# Altium schematic sheet FPGA_1_V1_01.SchDoc
size A2; Date: Date; CompanyName: HESSO; Engineer: Name; Address1: Route du Rawyl 47; Address2: 1950 Sion; Address3: Switzerland; ProjectName: Project Name
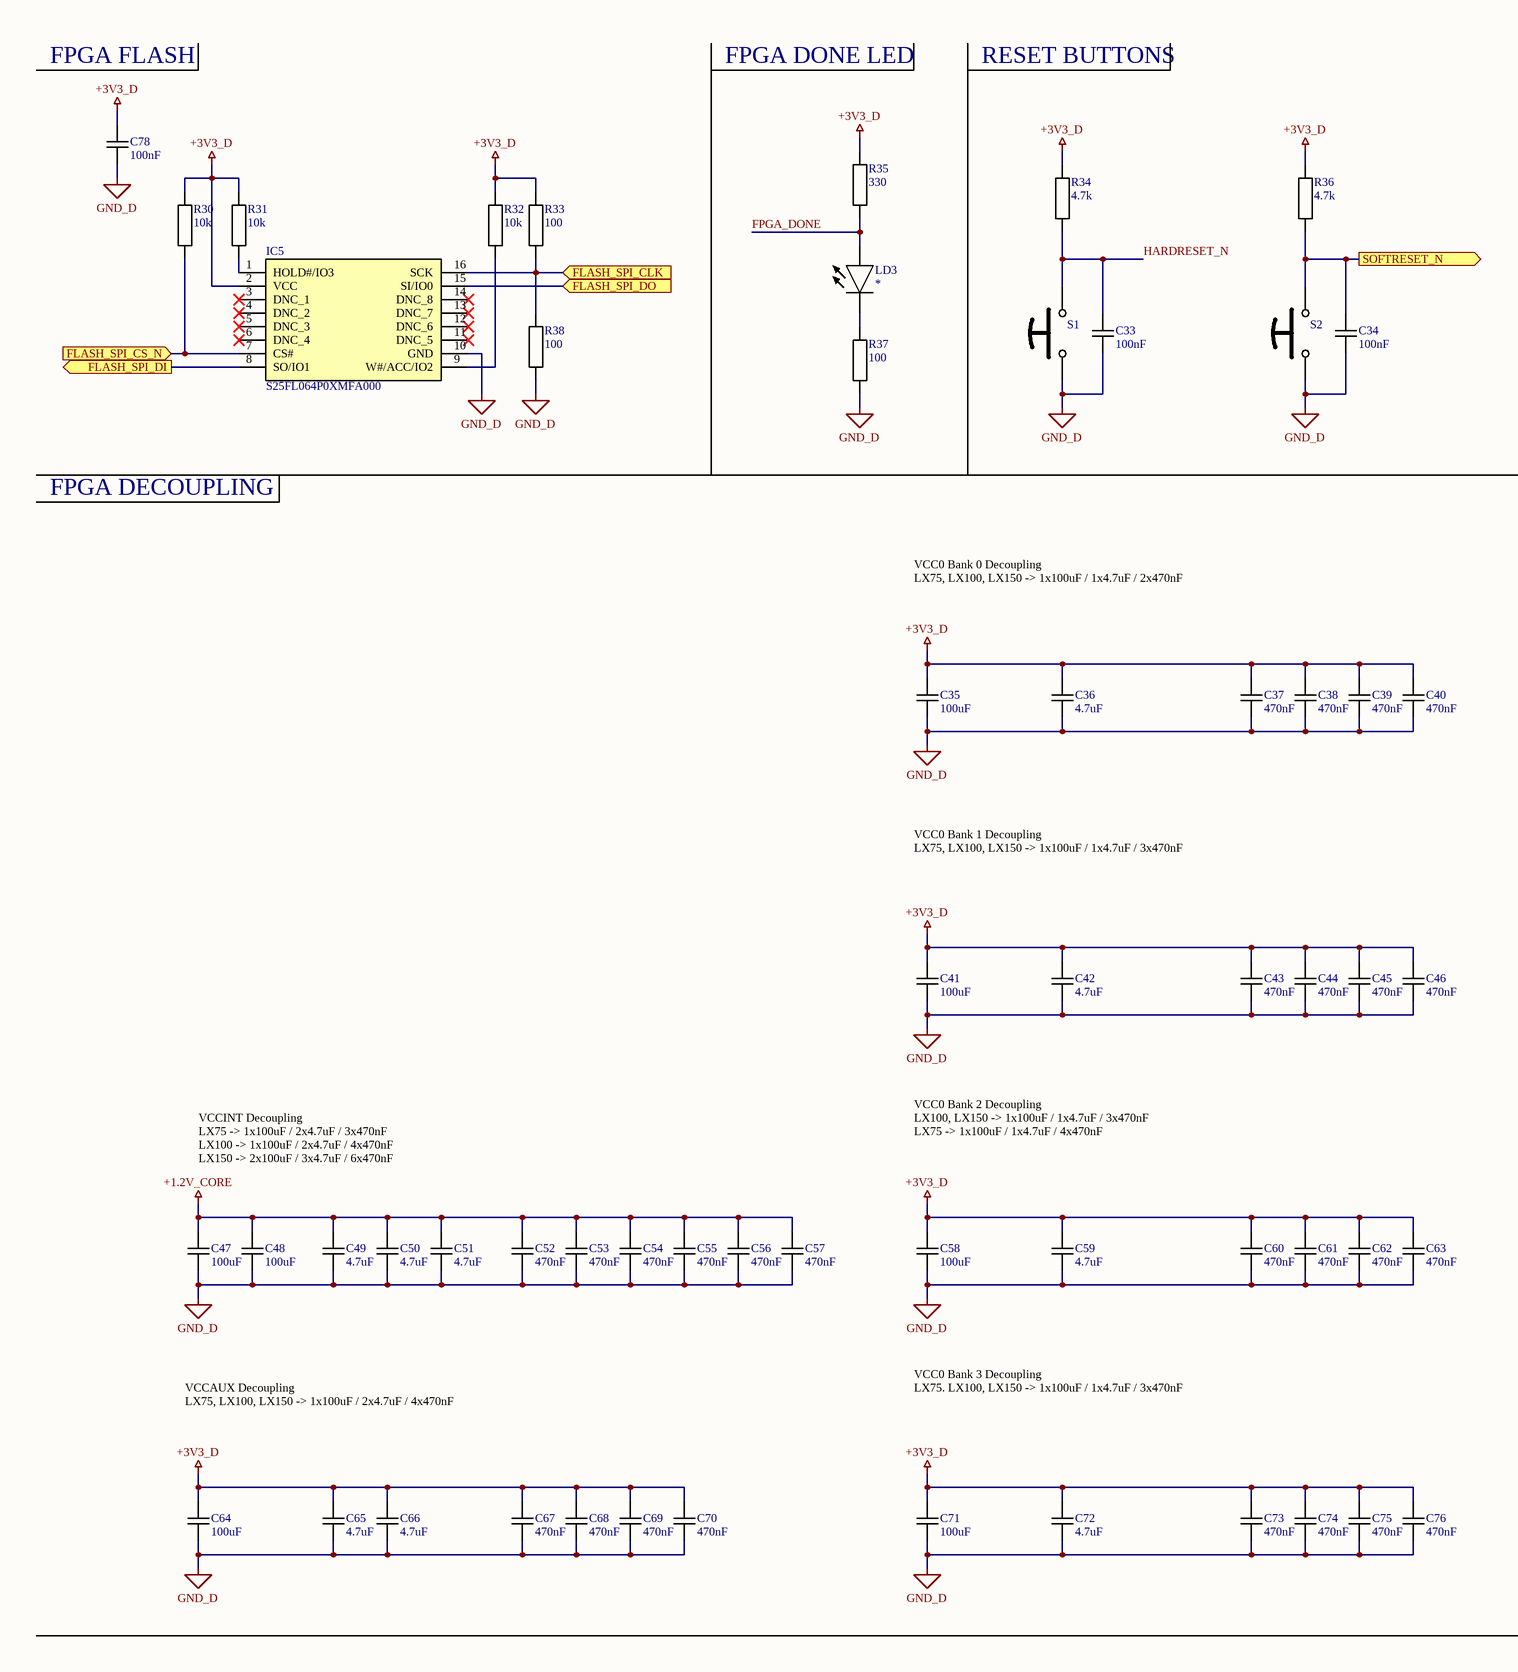
[diagram p0: FPGA_1_V1_01.SchDoc, left]
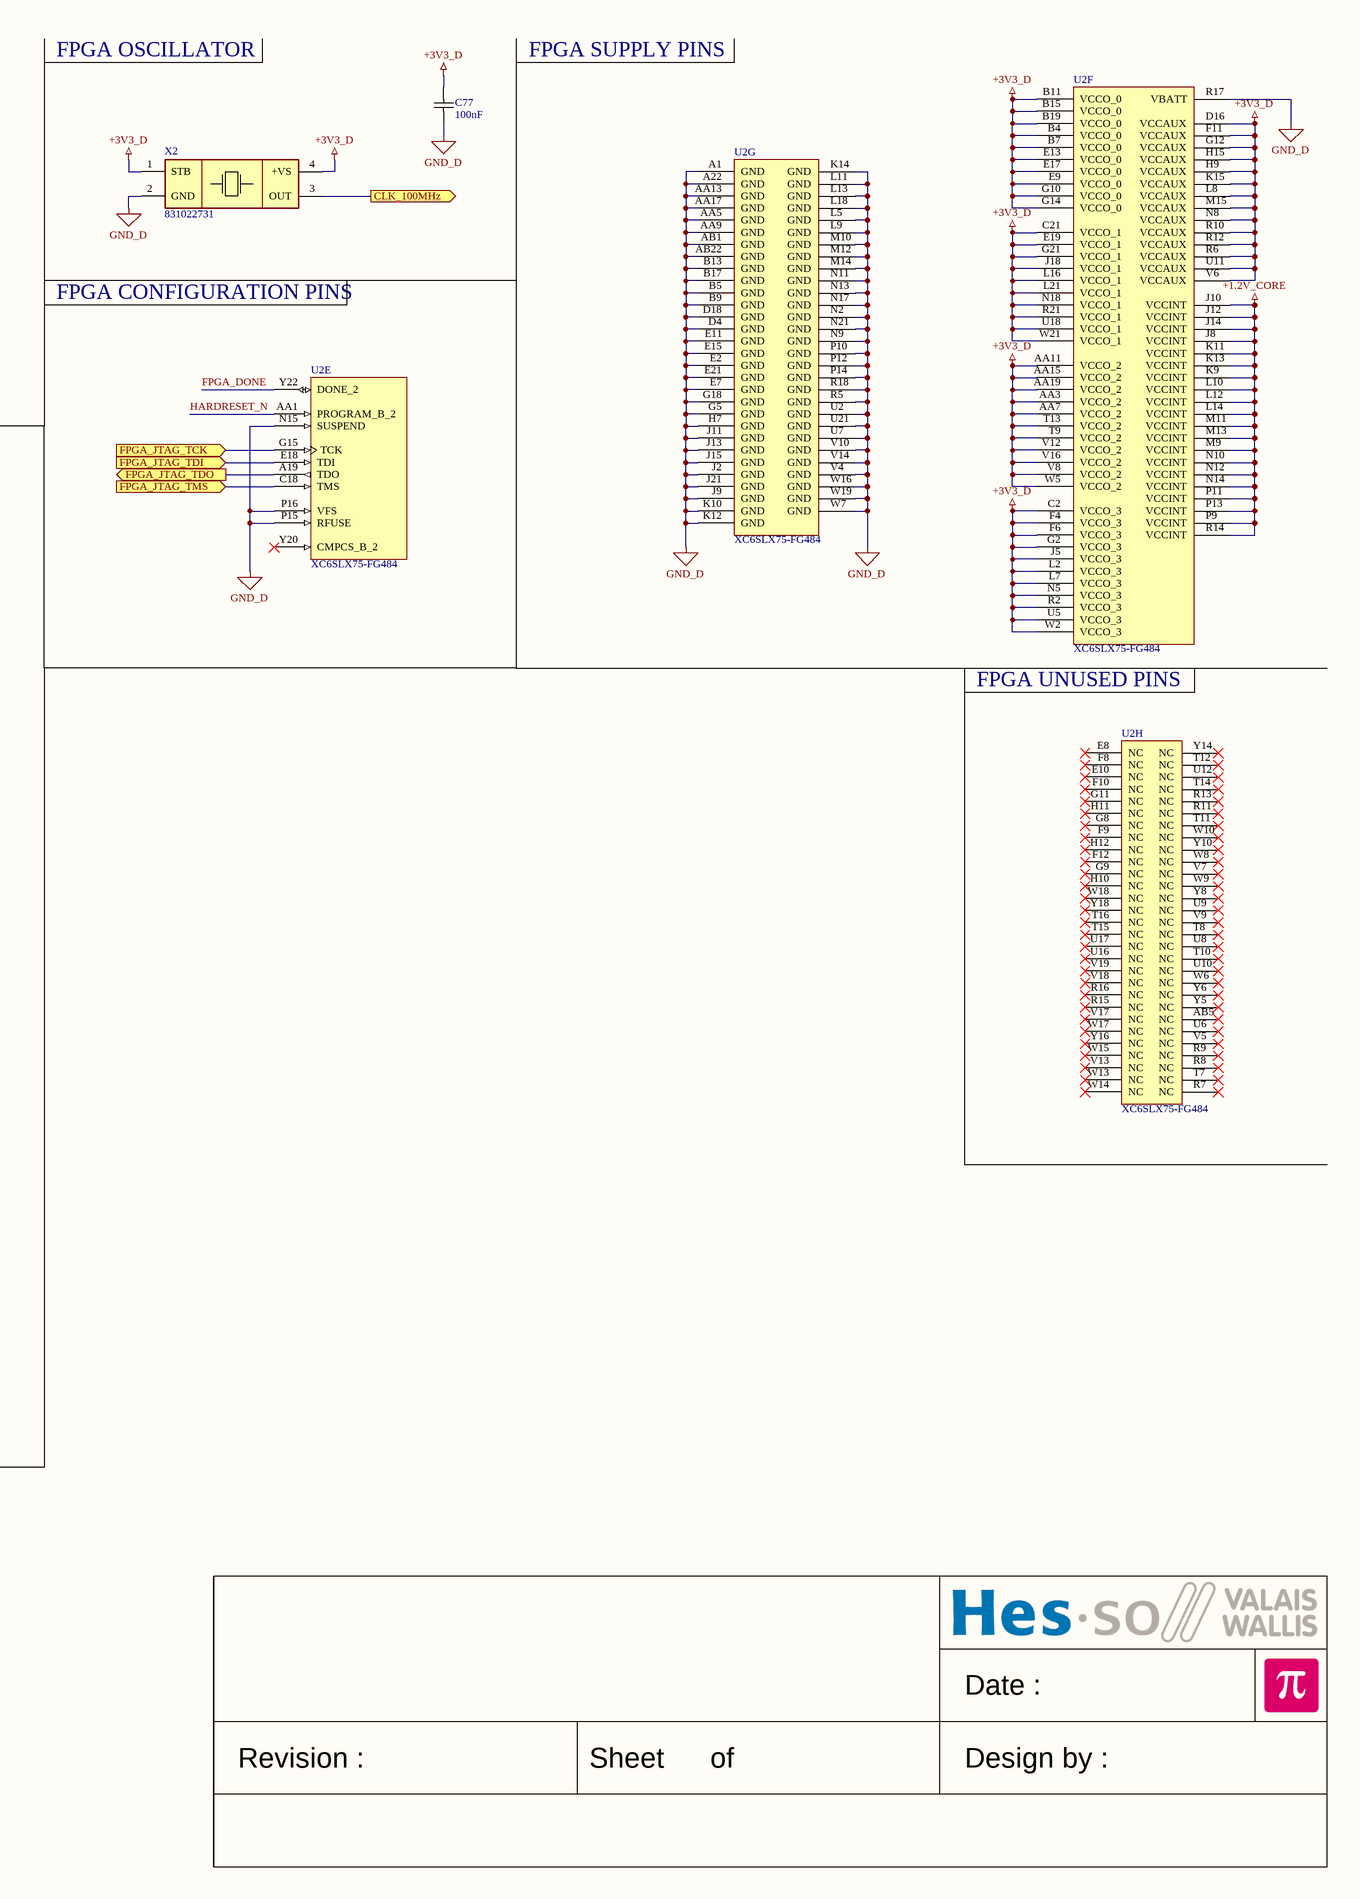
[diagram p1: FPGA_1_V1_01.SchDoc, right]

## Parts
C33  100nF  [CAPACITOR 1608 REFLOW]
C34  100nF  [CAPACITOR 1608 REFLOW]
C35  100uF  [CAPACITOR 3216 REFLOW]
C36  4.7uF  [CAPACITOR 1608 REFLOW]
C37  470nF  [CAPACITOR 1005 REFLOW]
C38  470nF  [CAPACITOR 1005 REFLOW]
C39  470nF  [CAPACITOR 1005 REFLOW]
C40  470nF  [CAPACITOR 1005 REFLOW]
C41  100uF  [CAPACITOR 3216 REFLOW]
C42  4.7uF  [CAPACITOR 1608 REFLOW]
C43  470nF  [CAPACITOR 1005 REFLOW]
C44  470nF  [CAPACITOR 1005 REFLOW]
C45  470nF  [CAPACITOR 1005 REFLOW]
C46  470nF  [CAPACITOR 1005 REFLOW]
C47  100uF  [CAPACITOR 3216 REFLOW]
C48  100uF  [CAPACITOR 3216 REFLOW]
C49  4.7uF  [CAPACITOR 1608 REFLOW]
C50  4.7uF  [CAPACITOR 1608 REFLOW]
C51  4.7uF  [CAPACITOR 1608 REFLOW]
C52  470nF  [CAPACITOR 1005 REFLOW]
C53  470nF  [CAPACITOR 1005 REFLOW]
C54  470nF  [CAPACITOR 1005 REFLOW]
C55  470nF  [CAPACITOR 1005 REFLOW]
C56  470nF  [CAPACITOR 1005 REFLOW]
C57  470nF  [CAPACITOR 1005 REFLOW]
C58  100uF  [CAPACITOR 3216 REFLOW]
C59  4.7uF  [CAPACITOR 1608 REFLOW]
C60  470nF  [CAPACITOR 1005 REFLOW]
C61  470nF  [CAPACITOR 1005 REFLOW]
C62  470nF  [CAPACITOR 1005 REFLOW]
C63  470nF  [CAPACITOR 1005 REFLOW]
C64  100uF  [CAPACITOR 3216 REFLOW]
C65  4.7uF  [CAPACITOR 1608 REFLOW]
C66  4.7uF  [CAPACITOR 1608 REFLOW]
C67  470nF  [CAPACITOR 1005 REFLOW]
C68  470nF  [CAPACITOR 1005 REFLOW]
C69  470nF  [CAPACITOR 1005 REFLOW]
C70  470nF  [CAPACITOR 1005 REFLOW]
C71  100uF  [CAPACITOR 3216 REFLOW]
C72  4.7uF  [CAPACITOR 1608 REFLOW]
C73  470nF  [CAPACITOR 1005 REFLOW]
C74  470nF  [CAPACITOR 1005 REFLOW]
C75  470nF  [CAPACITOR 1005 REFLOW]
C76  470nF  [CAPACITOR 1005 REFLOW]
C77  100nF  [CAPACITOR 1608 REFLOW]
C78  100nF  [CAPACITOR 1608 REFLOW]
IC5  S25FL064P0XMFA000  [SOIC127P1030X265-16N]
LD3  *  [LED 1608 REFLOW]
R30  10k  [RESISTOR 1608 REFLOW]
R31  10k  [RESISTOR 1608 REFLOW]
R32  10k  [RESISTOR 1608 REFLOW]
R33  100  [RESISTOR 1608 REFLOW]
R34  4.7k  [RESISTOR 1608 REFLOW]
R35  330  [RESISTOR 1608 REFLOW]
R36  4.7k  [RESISTOR 1608 REFLOW]
R37  100  [RESISTOR 1608 REFLOW]
R38  100  [RESISTOR 1608 REFLOW]
S1  *  [Push Button C6.0x3.5 Tyco FSMSM]  (value not drawn)
S2  *  [Push Button C6.0x3.5 Tyco FSMSM]  (value not drawn)
U2  XC6SLX75-FG484  [BGA484 P1.0 C23X23 H2.2]  (parts E,F,G,H of 8)
X2  831022731  [Oscillator C5.2x7.2 IQD LFSPXO]

## Ports
CLK_100MHz (out), FLASH_SPI_CLK (in), FLASH_SPI_CS_N (in), FLASH_SPI_DI (out), FLASH_SPI_DO (in), FPGA_JTAG_TCK (in), FPGA_JTAG_TDI (in), FPGA_JTAG_TDO (out), FPGA_JTAG_TMS (in), SOFTRESET_N (out)

## Nets
+1.2V_CORE: C47.1 C48.1 C49.1 C50.1 C51.1 C52.1 C53.1 C54.1 C55.1 C56.1 C57.1 U2.J8(VCCINT) U2.J10(VCCINT) U2.J12(VCCINT) U2.J14(VCCINT) U2.K9(VCCINT) U2.K11(VCCINT) U2.K13(VCCINT) U2.L10(VCCINT) U2.L12(VCCINT) U2.L14(VCCINT) U2.M9(VCCINT) U2.M11(VCCINT) U2.M13(VCCINT) U2.N10(VCCINT) U2.N12(VCCINT) U2.N14(VCCINT) U2.P9(VCCINT) U2.P11(VCCINT) U2.P13(VCCINT) U2.R14(VCCINT)
+3V3_D: C35.1 C36.1 C37.1 C38.1 C39.1 C40.1 C41.1 C42.1 C43.1 C44.1 C45.1 C46.1 C58.1 C59.1 C60.1 C61.1 C62.1 C63.1 C64.1 C65.1 C66.1 C67.1 C68.1 C69.1 C70.1 C71.1 C72.1 C73.1 C74.1 C75.1 C76.1 C77.2 C78.2 IC5.2(VCC) R30.2 R31.2 R32.2 R33.2 R34.2 R35.2 R36.2 U2.AA3(VCCO_2) U2.AA7(VCCO_2) U2.AA11(VCCO_2) U2.AA15(VCCO_2) U2.AA19(VCCO_2) U2.B4(VCCO_0) U2.B7(VCCO_0) U2.B11(VCCO_0) U2.B15(VCCO_0) U2.B19(VCCO_0) U2.C2(VCCO_3) U2.C21(VCCO_1) U2.D16(VCCAUX) U2.E9(VCCO_0) U2.E13(VCCO_0) U2.E17(VCCO_0) U2.E19(VCCO_1) U2.F4(VCCO_3) U2.F6(VCCO_3) U2.F11(VCCAUX) U2.G2(VCCO_3) U2.G10(VCCO_0) U2.G12(VCCAUX) U2.G14(VCCO_0) U2.G21(VCCO_1) U2.H9(VCCAUX) U2.H15(VCCAUX) U2.J5(VCCO_3) U2.J18(VCCO_1) U2.K15(VCCAUX) U2.L2(VCCO_3) U2.L7(VCCO_3) U2.L8(VCCAUX) U2.L16(VCCO_1) U2.L21(VCCO_1) U2.M15(VCCAUX) U2.N5(VCCO_3) U2.N8(VCCAUX) U2.N18(VCCO_1) U2.R2(VCCO_3) U2.R6(VCCAUX) U2.R10(VCCAUX) U2.R12(VCCAUX) U2.R21(VCCO_1) U2.T9(VCCO_2) U2.T13(VCCO_2) U2.U5(VCCO_3) U2.U11(VCCAUX) U2.U18(VCCO_1) U2.V6(VCCAUX) U2.V8(VCCO_2) U2.V12(VCCO_2) U2.V16(VCCO_2) U2.W2(VCCO_3) U2.W5(VCCO_2) U2.W21(VCCO_1) X2.1(STB) X2.4(+VS)
GND_D: C33.1 C34.1 C35.2 C36.2 C37.2 C38.2 C39.2 C40.2 C41.2 C42.2 C43.2 C44.2 C45.2 C46.2 C47.2 C48.2 C49.2 C50.2 C51.2 C52.2 C53.2 C54.2 C55.2 C56.2 C57.2 C58.2 C59.2 C60.2 C61.2 C62.2 C63.2 C64.2 C65.2 C66.2 C67.2 C68.2 C69.2 C70.2 C71.2 C72.2 C73.2 C74.2 C75.2 C76.2 C77.1 C78.1 IC5.10(GND) R37.1 R38.1 S1.1 S2.1 U2.A1(GND) U2.A22(GND) U2.AA5(GND) U2.AA9(GND) U2.AA13(GND) U2.AA17(GND) U2.AB1(GND) U2.AB22(GND) U2.B5(GND) U2.B9(GND) U2.B13(GND) U2.B17(GND) U2.D4(GND) U2.D18(GND) U2.E2(GND) U2.E7(GND) U2.E11(GND) U2.E15(GND) U2.E21(GND) U2.G5(GND) U2.G18(GND) U2.H7(GND) U2.J2(GND) U2.J9(GND) U2.J11(GND) U2.J13(GND) U2.J15(GND) U2.J21(GND) U2.K10(GND) U2.K12(GND) U2.K14(GND) U2.L5(GND) U2.L9(GND) U2.L11(GND) U2.L13(GND) U2.L18(GND) U2.M10(GND) U2.M12(GND) U2.M14(GND) U2.N2(GND) U2.N9(GND) U2.N11(GND) U2.N13(GND) U2.N15(SUSPEND) U2.N17(GND) U2.N21(GND) U2.P10(GND) U2.P12(GND) U2.P14(GND) U2.P15(RFUSE) U2.P16(VFS) U2.R5(GND) U2.R17(VBATT) U2.R18(GND) U2.U2(GND) U2.U7(GND) U2.U21(GND) U2.V4(GND) U2.V10(GND) U2.V14(GND) U2.W7(GND) U2.W16(GND) U2.W19(GND) X2.2(GND)
CLK_100MHz: X2.3(OUT) ; port CLK_100MHz
FLASH_SPI_CLK: IC5.16(SCK) R33.1 R38.2 ; port FLASH_SPI_CLK
FLASH_SPI_CS_N: IC5.7(CS#) R30.1 ; port FLASH_SPI_CS_N
FLASH_SPI_DI: IC5.8(SO/IO1) ; port FLASH_SPI_DI
FLASH_SPI_DO: IC5.15(SI/IO0) ; port FLASH_SPI_DO
FPGA_DONE: LD3.2(A) R35.1 U2.Y22(DONE_2)
FPGA_JTAG_TCK: U2.G15(TCK) ; port FPGA_JTAG_TCK
FPGA_JTAG_TDI: U2.E18(TDI) ; port FPGA_JTAG_TDI
FPGA_JTAG_TDO: U2.A19(TDO) ; port FPGA_JTAG_TDO
FPGA_JTAG_TMS: U2.C18(TMS) ; port FPGA_JTAG_TMS
HARDRESET_N: C33.2 R34.1 S1.2 U2.AA1(PROGRAM_B_2)
SOFTRESET_N: C34.2 R36.1 S2.2 ; port SOFTRESET_N
NetIC5_1: IC5.1(HOLD#/IO3) R31.1
NetIC5_9: IC5.9(W#/ACC/IO2) R32.1
NetLD3_1: LD3.1(C) R37.2

Not connected (* = marked no-connect by the designer): IC5 3(DNC_1)* 4(DNC_2)* 5(DNC_3)* 6(DNC_4)* 11(DNC_5)* 12(DNC_6)* 13(DNC_7)* 14(DNC_8)*; U2 AB5(NC)* E8(NC)* E10(NC)* F8(NC)* F9(NC)* F10(NC)* F12(NC)* G8(NC)* G9(NC)* G11(NC)* H10(NC)* H11(NC)* H12(NC)* R7(NC)* R8(NC)* R9(NC)* R11(NC)* R13(NC)* R15(NC)* R16(NC)* T7(NC)* T8(NC)* T10(NC)* T11(NC)* T12(NC)* T14(NC)* T15(NC)* T16(NC)* U6(NC)* U8(NC)* U9(NC)* U10(NC)* U12(NC)* U16(NC)* U17(NC)* V5(NC)* V7(NC)* V9(NC)* V13(NC)* V17(NC)* V18(NC)* V19(NC)* W6(NC)* W8(NC)* W9(NC)* W10(NC)* W13(NC)* W14(NC)* W15(NC)* W17(NC)* W18(NC)* Y5(NC)* Y6(NC)* Y8(NC)* Y10(NC)* Y14(NC)* Y16(NC)* Y18(NC)* Y20(CMPCS_B_2)*

## Notes on the sheet
- FPGA FLASH
- FPGA DONE LED
- RESET BUTTONS
- FPGA OSCILLATOR
- FPGA SUPPLY PINS
- FPGA CONFIGURATION PINS
- FPGA DECOUPLING
- VCC0 Bank 0 Decoupling
  LX75, LX100, LX150 -> 1x100uF / 1x4.7uF / 2x470nF
- (near U2) FPGA UNUSED PINS
- VCC0 Bank 1 Decoupling
  LX75, LX100, LX150 -> 1x100uF / 1x4.7uF / 3x470nF
- VCCINT Decoupling
  LX75 -> 1x100uF / 2x4.7uF / 3x470nF
  LX100 -> 1x100uF / 2x4.7uF / 4x470nF
  LX150 -> 2x100uF / 3x4.7uF / 6x470nF
- VCC0 Bank 2 Decoupling
  LX100, LX150 -> 1x100uF / 1x4.7uF / 3x470nF
  LX75 -> 1x100uF / 1x4.7uF / 4x470nF
- VCCAUX Decoupling
  LX75, LX100, LX150 -> 1x100uF / 2x4.7uF / 4x470nF
- VCC0 Bank 3 Decoupling
  LX75. LX100, LX150 -> 1x100uF / 1x4.7uF / 3x470nF
- Date :
- Revision :
- Sheet
- of
- Design by :

## Library data of the parts
C33-C78 = Capacitor
  C33 C34 C77 C78: Value: 100nF
  C35 C41 C47 C48 C58 C64 C71: Value: 100uF
  C36 C42 C49-C51 C59 C65 C66 C72: Value: 4.7uF
  C37-C40 C43-C46 C52-C57 C60-C63 C67-C70 C73-C76: Value: 470nF
IC5 = S25FL064P0XMFA000: Integrated Circuit; Manufacturer_Name: Cypress Semiconductor; Datasheet Link: https://www.cypress.com/file/196856/download; Height: 2.65mm; Manufacturer_Part_Number: S25FL064P0XMFA000; Mouser Part Number: 727-S25FL064P0XMFA00; Mouser Price/Stock: https://www.mouser.co.uk/ProductDetail/Cypress-Semiconductor/S25FL064P0XMFA000?qs=oeTp6q%252Bm7GOWFbkeKvUJ6w%3D%3D; Arrow Part Number: S25FL064P0XMFA000; Arrow Price/Stock: https://www.arrow.com/en/products/s25fl064p0xmfa000/cypress-semiconductor
LD3 = LED: LED generic; Value: *
R30-R33 R38 = Resistor: Resistor 1% 50V 100mW 1608(0603)
  R30-R32: Value: 10k
  R33 R38: Value: 100
R34-R37 = Resistor: Resistor 1% 50V 125mW 2012(0805)
  R34 R36: Value: 4.7k
  R35: Value: 330
  R37: Value: 100
S1 S2 = Push Button 2Pins: Push Button, 2 pins; Value: *
U2 = XC6SLX75-FG484: Spartan-6 LXT 1.2V FPGA, 268 User I/Os, 484-Ball Fine-Pitch BGA (1.0mm Pitch); Value: XC6SLX75-FG484
X2 = Oscillator C5.2x7.2 IQD LFSPXO: Value: 831022731; MouserNumber: 710-831022731